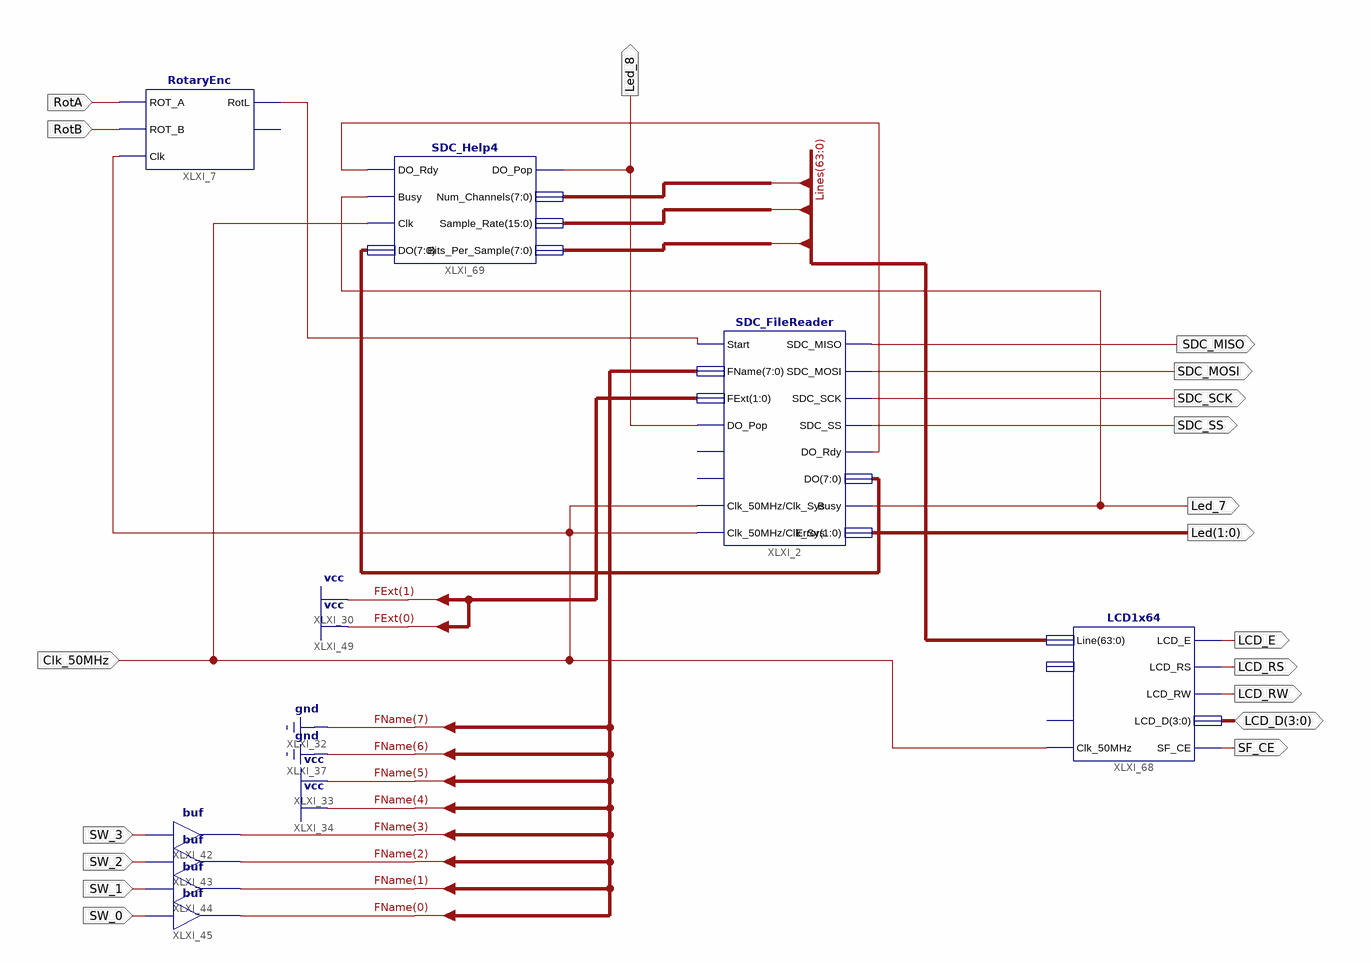
[diagram p0: schematic sheet 1]
// Xilinx ISE schematic Plytka.sch (spartan3e) as structural Verilog: 8 symbols, 19 ports
module Plytka (
  input  RotA,
  input  RotB,
  input  Clk_50MHz,
  input  SW_3,
  input  SW_2,
  input  SW_1,
  input  SW_0,
  input  SDC_MISO,
  inout  [3:0] LCD_D,
  output Led_7,
  output [1:0] Led,
  output SDC_MOSI,
  output SDC_SCK,
  output SDC_SS,
  output Led_8,
  output LCD_E,
  output LCD_RS,
  output LCD_RW,
  output SF_CE
);

  wire XLXN_51, XLXN_61;
  wire [3:0] FName;
  wire [7:0] XLXN_49;
  wire [63:0] Lines;

  SDC_FileReader XLXI_2 (
    .SDC_MISO(SDC_MISO), .Start(XLXN_61), .FName({4'b0011, FName}), .Clk_50MHz(Clk_50MHz), .DO_Pop(Led_8),
    .SDC_MOSI(SDC_MOSI), .SDC_SCK(SDC_SCK), .SDC_SS(SDC_SS), .Error(Led), .DO(XLXN_49), .DO_Rdy(XLXN_51),
    .Busy(Led_7), .FExt(2'b11), .Clk_Sys(Clk_50MHz));  // open: Reset, Abort
  RotaryEnc XLXI_7 (.ROT_A(RotA), .ROT_B(RotB), .RotL(XLXN_61), .Clk(Clk_50MHz));  // open: RotR
  buf XLXI_42 (FName[3], SW_3);
  buf XLXI_43 (FName[2], SW_2);
  buf XLXI_44 (FName[1], SW_1);
  buf XLXI_45 (FName[0], SW_0);
  LCD1x64 XLXI_68 (
    .Clk_50MHz(Clk_50MHz), .Line(Lines), .LCD_D(LCD_D), .LCD_E(LCD_E), .LCD_RW(LCD_RW), .LCD_RS(LCD_RS),
    .SF_CE(SF_CE));  // open: Reset, Blank
  SDC_Help4 XLXI_69 (
    .DO_Rdy(XLXN_51), .Busy(Led_7), .Clk(Clk_50MHz), .DO(XLXN_49), .DO_Pop(Led_8),
    .Num_Channels(Lines[63:56]), .Sample_Rate(Lines[24:9]), .Bits_Per_Sample(Lines[33:26]));
endmodule
